# Altium schematic sheet handheld_main.SchDoc: DE:HANDHELD
size 209 x 144 mm; SheetNumber: 2; SheetTotal: 2; WebFGR: www.abebashop.com; VersionFGR: 20220726; PageSetup: Record=PageOptions|CenterHorizontal=True|CenterVertical=True|PrintScale=1.40|XCorrection=1.00|YCorrection=1.00|PrintKind=0|BorderSize=5000000|LeftOffset=0|BottomOffset=0|Orientation=2|PaperLength=1000|PaperWidth=1000|Scale=100|PaperSource=7|PrintQuality=-4|MediaType=1|DitherType=10|PaperKind=A4|PrintScaleMode=1
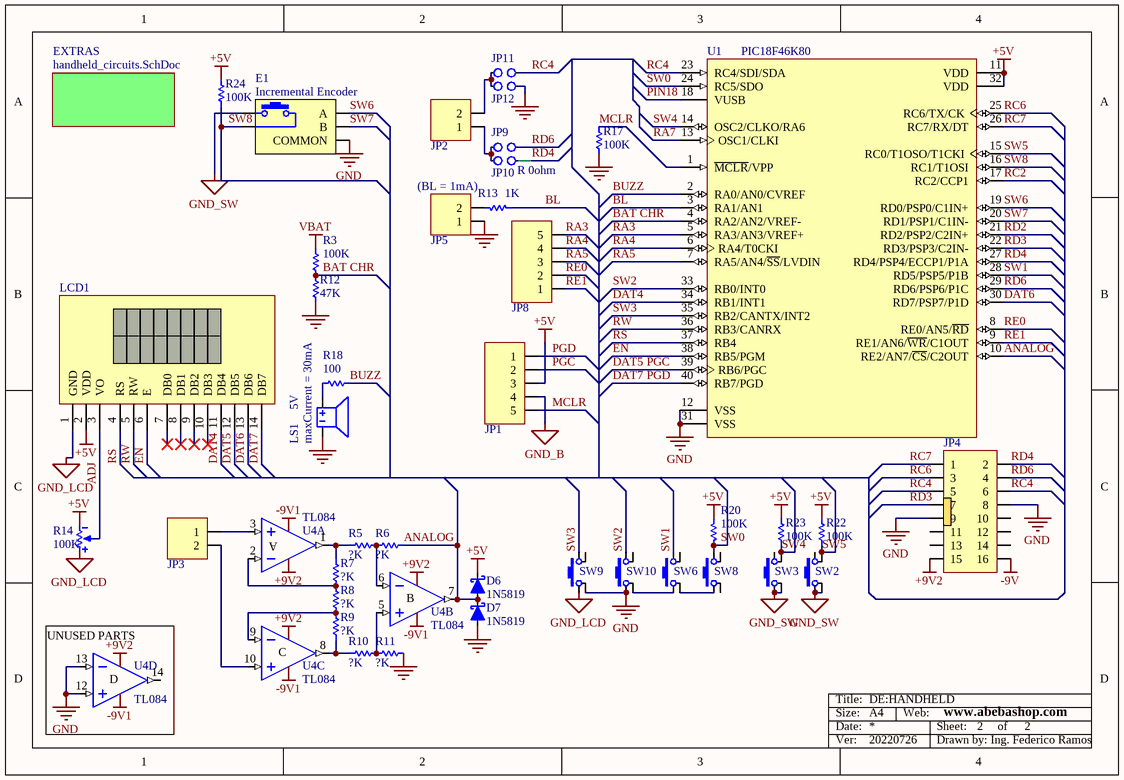
[diagram p0: handheld_main.SchDoc]

## Parts
D6  1N5819  [d_do41]
D7  1N5819  [d_do41]
E1  Incremental Encoder  [encoder]
JP1  Header5x1  [HDR5x1]  (value not drawn)
JP2  XY128V-A2P  [bornera2]  (value not drawn)
JP3  XY128V-A2P  [bornera2]  (value not drawn)
JP4  IDC 8x2 90deg  [idc8x2_90]  (value not drawn)
JP5  Header2x1  [CONPOL2X1]  (value not drawn)
JP8  Header5x1  [HDR5x1]  (value not drawn)
JP9  Jumper 2 contactos; Soldadura  [JUMPER2]  (value not drawn)
JP10  Jumper 2 contactos; Soldadura  [JUMPER2]  (value not drawn)
JP11  Jumper 2 contactos; Soldadura  [JUMPER2]  (value not drawn)
JP12  Jumper 2 contactos; Soldadura  [JUMPER2]  (value not drawn)
LCD1  LCD 8X2  [LCD_0802]  (value not drawn)
LS1  5V  Price: maxCurrent = 30mA  [ENC_SON_BUZ_12MM]
R3  Resistencia: 100K  [R1206]  (hidden comment: Resistencia 1206; 1Kohm)
R5  Resistencia: ?K  [RES300TH]  (hidden comment: Resistencia 1206; 1Kohm)
R6  Resistencia: ?K  [RES300TH]  (hidden comment: Resistencia 1206; 1Kohm)
R7  Resistencia: ?K  [RES300TH]  (hidden comment: Resistencia 1206; 1Kohm)
R8  Resistencia: ?K  [RES300TH]  (hidden comment: Resistencia 1206; 1Kohm)
R9  Resistencia: ?K  [RES300TH]  (hidden comment: Resistencia 1206; 1Kohm)
R10  Resistencia: ?K  [RES300TH]  (hidden comment: Resistencia 1206; 1Kohm)
R11  Resistencia: ?K  [RES300TH]  (hidden comment: Resistencia 1206; 1Kohm)
R12  Resistencia: 47K  [R1206]  (hidden comment: Resistencia 1206; 1Kohm)
R13  Codigo Elemon: (BL = 1mA)  Resistencia: 1K  [R1206]  (hidden comment: Resistencia 1206; 1Kohm)
R14  value 100K  [PRESET6]  (hidden comment: Preset)
R17  Resistencia: 100K  [RES300TH]  (hidden comment: Resistencia 1206; 1Kohm)
R18  Resistencia: 100  [R1206]  (hidden comment: Resistencia 1206; 1Kohm)
R20  Resistencia: 100K  [R1206]  (hidden comment: Resistencia 1206; 1Kohm)
R22  Resistencia: 100K  [R1206]  (hidden comment: Resistencia 1206; 1Kohm)
R23  Resistencia: 100K  [R1206]  (hidden comment: Resistencia 1206; 1Kohm)
R24  Resistencia: 100K  [R1206]  (hidden comment: Resistencia 1206; 1Kohm)
R27  R 0ohm  [R1206]
SW2  SW_T_17-5MM  [SW_T_17-5MM]  (value not drawn)
SW3  SW_T_17-5MM  [SW_T_17-5MM]  (value not drawn)
SW6  SW_T_17-5MM  [SW_T_17-5MM]  (value not drawn)
SW8  SW_T_17-5MM  [SW_T_17-5MM]  (value not drawn)
SW9  SW_T_17-5MM  [SW_T_17-5MM]  (value not drawn)
SW10  SW_T_17-5MM  [SW_T_17-5MM]  (value not drawn)
U1  PIC18F46K80  [DIP40Z_MICROCHIP]
U4  TL084  [DIP14Z]  (parts A,B,C,D of 4)

## Sub-sheets
EXTRAS = handheld_circuits.SchDoc: no entries

## Nets
+5V: D6.2(K) JP1.3 LCD1.2(VDD) R14.3 R20.1 R22.1 R23.1 R24.1 U1.11(VDD) U1.32(VDD)
+9V2: JP4.15 U4.4(V+)
-9V: JP4.16
-9V1: U4.11(V-)
GND: D7.1(A) E1.2(COMMON) JP4.8 JP4.9 JP5.1 JP12.2 LS1.2 R11.2 R12.2 R17.2 SW9.2 SW10.4 U1.12(VSS) U1.31(VSS) U4.12(IN+) U4.13(IN-)
GND_B: JP1.4
GND_LCD: LCD1.1(GND) R14.1 SW9.4
GND_SW: E1.4 SW2.2 SW2.4 SW3.2 SW3.4
VBAT: R3.1
ADJ: LCD1.3(VO) R14.2
ANALOG: D6.1(A) D7.2(K) R6.2 U1.10(RE2/AN7/~{CS}/C2OUT) U4.7(OUT)
BAT CHR: R3.2 R12.1 U1.4(RA2/AN2/VREF-)
BL: R13.1 U1.3(RA1/AN1)
BUZZ: R18.2 U1.2(RA0/AN0/CVREF)
DAT4: LCD1.11(DB4) U1.34(RB1/INT1)
DAT5: JP1.2 LCD1.12(DB5) U1.39(RB6/PGC)  [also labelled PGC]
DAT6: LCD1.13(DB6) U1.30(RD7/PSP7/P1D)
DAT7: JP1.1 LCD1.14(DB7) U1.40(RB7/PGD)  [also labelled PGD]
EN: LCD1.6(E) U1.38(RB5/PGM)
MCLR: JP1.5 R17.1 U1.1(~{MCLR}/VPP)
PIN18: U1.18(VUSB)
RA3: JP8.5 U1.5(RA3/AN3/VREF+)
RA4: JP8.4 U1.6(RA4/T0CKI)
RA5: JP8.3 U1.7(RA5/AN4/~{SS}/LVDIN)
RA7: U1.13(OSC1/CLKI)
RC2: U1.17(RC2/CCP1)
RC4: JP4.5 JP4.6 JP11.2 U1.23(RC4/SDI/SDA)
RC6: JP4.3 U1.25(RC6/TX/CK)
RC7: JP4.1 U1.26(RC7/RX/DT)
RD2: U1.21(RD2/PSP2/C2IN+)
RD3: JP4.7 U1.22(RD3/PSP3/C2IN-)
RD4: JP4.2 R27.1 U1.27(RD4/PSP4/ECCP1/P1A)
RD6: JP4.4 JP9.2 U1.29(RD6/PSP6/P1C)
RE0: JP8.2 U1.8(RE0/AN5/~{RD})
RE1: JP8.1 U1.9(RE1/AN6/~{WR}/C1OUT)
RS: LCD1.4(RS) U1.37(RB4)
RW: LCD1.5(RW) U1.36(RB3/CANRX)
SW0: R20.2 SW8.3 U1.24(RC5/SDO)
SW1: SW6.3 U1.28(RD5/PSP5/P1B)
SW2: SW10.3 U1.33(RB0/INT0)
SW3: SW9.3 U1.35(RB2/CANTX/INT2)
SW4: R23.2 SW3.1 U1.14(OSC2/CLKO/RA6)
SW5: R22.2 SW2.1 U1.15(RC0/T1OSO/T1CKI)
SW6: E1.1(A) U1.19(RD0/PSP0/C1IN+)
SW7: E1.3(B) U1.20(RD1/PSP1/C1IN-)
SW8: E1.5 R24.2 U1.16(RC1/T1OSI)
NetJP2_1: JP2.1 JP9.1 JP10.1
NetJP2_2: JP2.2 JP11.1 JP12.1
NetJP3_1: JP3.1 U4.3(IN+)
NetJP3_2: JP3.2 U4.10(IN+)
NetJP5_2: JP5.2 R13.2
NetJP10_2: JP10.2 R27.2
NetLS1_1: LS1.1 R18.1
NetR5_1: R5.1 R7.1 U4.1(OUT)
NetR5_2: R5.2 R6.1 U4.6(IN-)
NetR7_2: R7.2 R8.1 U4.2(IN-)
NetR8_2: R8.2 R9.1 U4.9(IN-)
NetR9_2: R9.2 R10.1 U4.8(OUT)
NetR10_2: R10.2 R11.1 U4.5(IN+)
NetSW6_2: SW6.2 SW8.4
NetSW6_4: SW6.4 SW10.2

Not connected (* = marked no-connect by the designer): JP4 10 11 12 13 14; LCD1 7(DB0)* 8(DB1)* 9(DB2)* 10(DB3)*; SW2 3; SW3 3; SW6 1; SW8 1 2; SW9 1; SW10 1; U4 14(OUT)

## Notes on the sheet
- (near U4) UNUSED PARTS
- Title:
- Size:
- Date:
- A4
- Web:
- Sheet:
- of
- Ver:
- Drawn by: Ing. Federico Ramos
- (in symbol TL084, part A) A
- (in symbol TL084, part B) B
- (in symbol TL084, part C) C
- (in symbol TL084, part D) D

## Library data of the parts
D6 D7 = 1N5819: Schottky Diode 1A 40V; Revision: July-2002: Re-released for DXP Platform.
E1 = Incremental Encoder: Incremental Encoder with Switch; Price: ?
JP1 JP8 = Header5x1: Header 5x1; Price: ?
JP2 JP3 = Bornera Tornillos 2x1; Altura = 13.8mm: Codigo Elemon: MC5811820; Dolares Elemon: 0.27574
JP5 = Header2x1: Header 2x1; Price: ?
LS1 = Buzzer
R3 R5-R12 R17 R18 R22-R24 = Resistencia 1206; 1Kohm: Codigo Elemon: RS3886185; Dolares Elemon: 0.00720
R13 = Resistencia 1206; 1Kohm: Dolares Elemon: 0.00720
R14 = Preset: Resistencia Variable
R20 = Resistencia 1206; 1Kohm: Codigo Elemon: (BL = 1mA); Dolares Elemon: 0.00720
R27 = Resistencia 1206; 0ohm: Codigo Elemon: RS3885900; Dolares Elemon: 0.00720
U1 = PIC18F4620: FLASH Microcontroller
U4 = TL084: JFET-Input Operational Amplifier; Revision: 17-Jul-2002: Re-released for DXP Platform.
JP4 = IDC 8x2 90deg: Price: ?
LCD1 = LCD 8X2: Price: ?
SW2 SW3 SW6 SW8-SW10 = SW_T_17-5MM: Price: ?